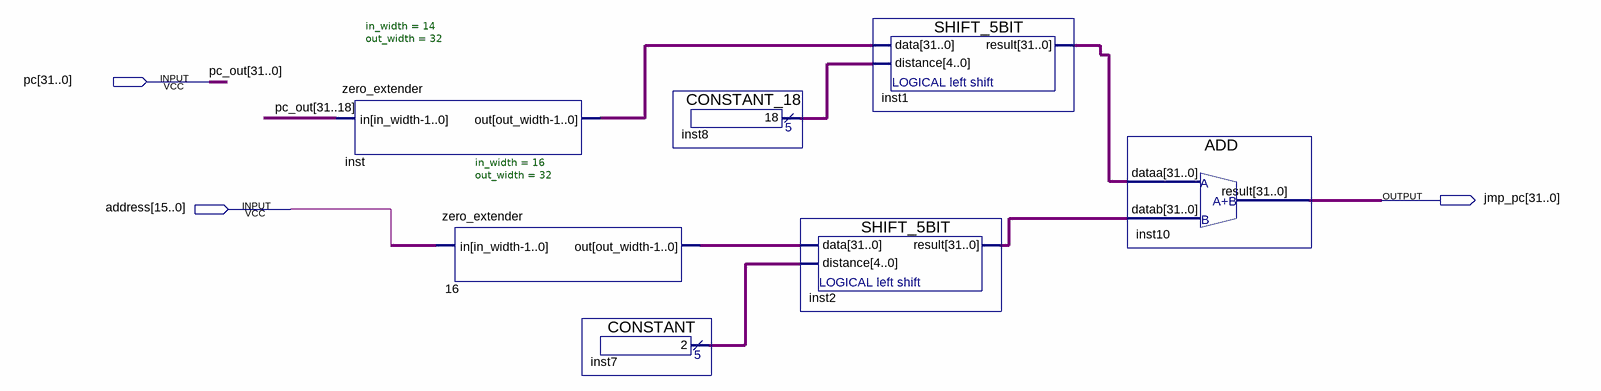
[diagram p0: schematic sheet]
// Quartus schematic JMP.bdf as structural Verilog: 7 symbols, 3 pins
module JMP (
  input  [31:0] pc,
  input  [15:0] address,
  output [31:0] jmp_pc
);

  wire [4:0] inst7_result, inst8_result;
  wire [15:0] undriven;
  wire [31:0] inst1_result, inst2_result, inst_out, n16_out;

  zero_extender #(.in_width(14), .out_width(32)) inst (.in(pc[31:18]), .out(inst_out));
  zero_extender #(.in_width(16), .out_width(32)) u_16 (.in(undriven), .out(n16_out));
  CONSTANT inst7 (.result(inst7_result));
  CONSTANT_18 inst8 (.result(inst8_result));
  SHIFT_5BIT inst2 (.data(n16_out), .distance(inst7_result), .result(inst2_result));
  SHIFT_5BIT inst1 (.data(inst_out), .distance(inst8_result), .result(inst1_result));
  ADD inst10 (.dataa(inst1_result), .datab(inst2_result), .result(jmp_pc));

  // Other names for the same wires on the sheet: pc_out[31:0] = pc
endmodule
